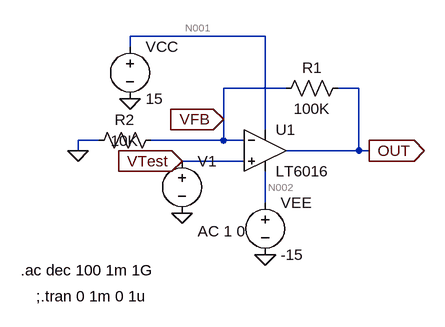
[diagram p0: schematic non_inverting.asc]
* non_inverting.asc
* U1: LT6016 (symbol OpAmps\LT6016 not available, pins judged from their places): In+=VTest In-=VFB V+=N001 V-=N002 OUT=OUT
VCC N001 0 15
VEE N002 0 -15
V1 VTest 0 AC 1 0
R1 OUT VFB 100K
R2 VFB 0 10K
.ac dec 100 1m 1G
;.tran 0 1m 0 1u
.backanno
.end

* Results of the author's LTspice run, read from the files saved beside the schematic
* Operating Point, zero values left out:
*   V(n002) = -15 V
*   V(n001) = 15 V
*   V(out) = 176.5 µV
*   V(vfb) = -20.2 nV
*   I(R2) = -2.02 pA
*   I(R1) = 1.765 nA
*   I(V1) = -1.767 nA
*   I(Vee) = 345.9 µA
*   I(Vcc) = -345.9 µA
*   Ix(u1:1) = 1.767 nA
*   Ix(u1:2) = 1.767 nA
*   Ix(u1:3) = 345.9 µA
*   Ix(u1:4) = -345.9 µA
*   Ix(u1:5) = -1.751 nA
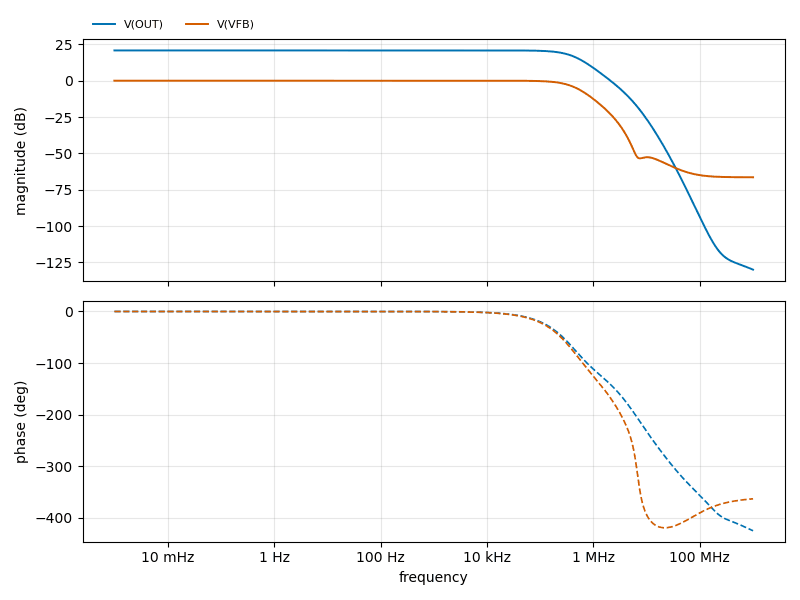
[diagram p1: AC Analysis of non_inverting.asc, plotted from the saved traces]
* AC Analysis, 1 run:
*   V(OUT): 20.83 dB at 1 mHz, -130.06 dB at 1 GHz, peak 20.83 dB at 1 mHz, 3 dB below the peak at 348.1 kHz
*   V(VFB): -0.00 dB at 1 mHz, -66.47 dB at 1 GHz, peak -0.00 dB at 2.57 mHz, 3 dB below the peak at 343.2 kHz